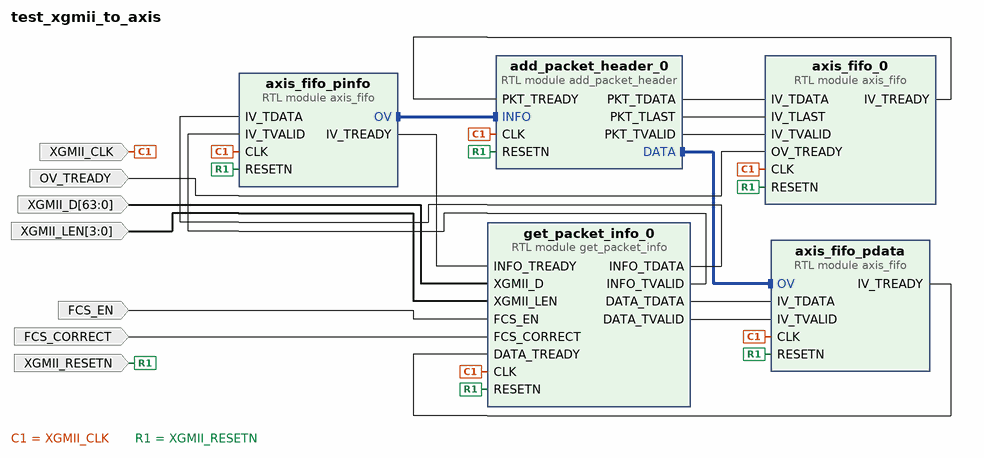
[diagram p0: block diagram of the top level]
# Vivado block design test_xgmii_to_axis, xcku115-flvb2104-2-e, Vivado 2018.2
create_bd_design test_xgmii_to_axis

create_bd_port -dir I -type clk XGMII_CLK
set_property -dict {CONFIG.FREQ_HZ 156250000} [get_bd_ports XGMII_CLK]
create_bd_port -dir I -type rst XGMII_RESETN
create_bd_port -dir I -from 63 -to 0 XGMII_D
create_bd_port -dir I -from 3 -to 0 XGMII_LEN
create_bd_port -dir I FCS_EN
create_bd_port -dir I FCS_CORRECT
create_bd_port -dir I OV_TREADY

create_bd_cell -type module -reference add_packet_header add_packet_header_0
create_bd_cell -type module -reference get_packet_info get_packet_info_0
create_bd_cell -type module -reference axis_fifo axis_fifo_0
set_property -dict {CONFIG.FIFO_SIZE_L2 0} [get_bd_cells axis_fifo_0]
create_bd_cell -type module -reference axis_fifo axis_fifo_pdata
set_property -dict [list \
  CONFIG.WIDTH_LAST 0 \
  CONFIG.FIFO_SIZE_L2 11 \
  CONFIG.FIFO_REG 5 \
  CONFIG.FIFO_DELAY 2 \
] [get_bd_cells axis_fifo_pdata]
create_bd_cell -type module -reference axis_fifo axis_fifo_pinfo
set_property -dict [list \
  CONFIG.WIDTH_DATA 24 \
  CONFIG.WIDTH_LAST 0 \
  CONFIG.FIFO_SIZE_L2 10 \
  CONFIG.FIFO_REG 5 \
] [get_bd_cells axis_fifo_pinfo]

# ---- connections ----

connect_bd_intf_net -intf_net axis_fifo_0_OV [get_bd_intf_pins add_packet_header_0/DATA] [get_bd_intf_pins axis_fifo_pdata/OV]
connect_bd_intf_net [get_bd_intf_pins axis_fifo_pinfo/OV] [get_bd_intf_pins add_packet_header_0/INFO]
connect_bd_net [get_bd_ports XGMII_CLK] \
  [get_bd_pins add_packet_header_0/CLK] [get_bd_pins get_packet_info_0/CLK] [get_bd_pins axis_fifo_0/CLK] \
  [get_bd_pins axis_fifo_pdata/CLK] [get_bd_pins axis_fifo_pinfo/CLK]
connect_bd_net [get_bd_ports XGMII_RESETN] \
  [get_bd_pins add_packet_header_0/RESETN] [get_bd_pins get_packet_info_0/RESETN] [get_bd_pins axis_fifo_0/RESETN] \
  [get_bd_pins axis_fifo_pdata/RESETN] [get_bd_pins axis_fifo_pinfo/RESETN]
connect_bd_net [get_bd_pins add_packet_header_0/PKT_TDATA] [get_bd_pins axis_fifo_0/IV_TDATA]
connect_bd_net [get_bd_pins add_packet_header_0/PKT_TLAST] [get_bd_pins axis_fifo_0/IV_TLAST]
connect_bd_net [get_bd_pins add_packet_header_0/PKT_TVALID] [get_bd_pins axis_fifo_0/IV_TVALID]
connect_bd_net [get_bd_pins axis_fifo_0/IV_TREADY] [get_bd_pins add_packet_header_0/PKT_TREADY]
connect_bd_net [get_bd_pins axis_fifo_pdata/IV_TREADY] [get_bd_pins get_packet_info_0/DATA_TREADY]
connect_bd_net [get_bd_pins axis_fifo_pinfo/IV_TREADY] [get_bd_pins get_packet_info_0/INFO_TREADY]
connect_bd_net [get_bd_pins get_packet_info_0/DATA_TDATA] [get_bd_pins axis_fifo_pdata/IV_TDATA]
connect_bd_net [get_bd_pins get_packet_info_0/DATA_TVALID] [get_bd_pins axis_fifo_pdata/IV_TVALID]
connect_bd_net [get_bd_pins get_packet_info_0/INFO_TDATA] [get_bd_pins axis_fifo_pinfo/IV_TDATA]
connect_bd_net [get_bd_pins get_packet_info_0/INFO_TVALID] [get_bd_pins axis_fifo_pinfo/IV_TVALID]
connect_bd_net -net XGMII_D_0_1 [get_bd_ports XGMII_D] [get_bd_pins get_packet_info_0/XGMII_D]
connect_bd_net -net XGMII_LEN_0_1 [get_bd_ports XGMII_LEN] [get_bd_pins get_packet_info_0/XGMII_LEN]
connect_bd_net -net FCS_EN_0_1 [get_bd_ports FCS_EN] [get_bd_pins get_packet_info_0/FCS_EN]
connect_bd_net -net FCS_CORRECT_0_1 [get_bd_ports FCS_CORRECT] [get_bd_pins get_packet_info_0/FCS_CORRECT]
connect_bd_net -net OV_TREADY_0_1 [get_bd_ports OV_TREADY] [get_bd_pins axis_fifo_0/OV_TREADY]

validate_bd_design
save_bd_design
